# EasyEDA schematic SCH_RE2-YM2151 v0.2_2024-01-16.json

## Sheets
1 OPM: TITLE: Sheet_1; REV: 1.0; Date: 2024-01-08; Sheet: 1/1; Drawn By: Denjhang; Company: Your Company
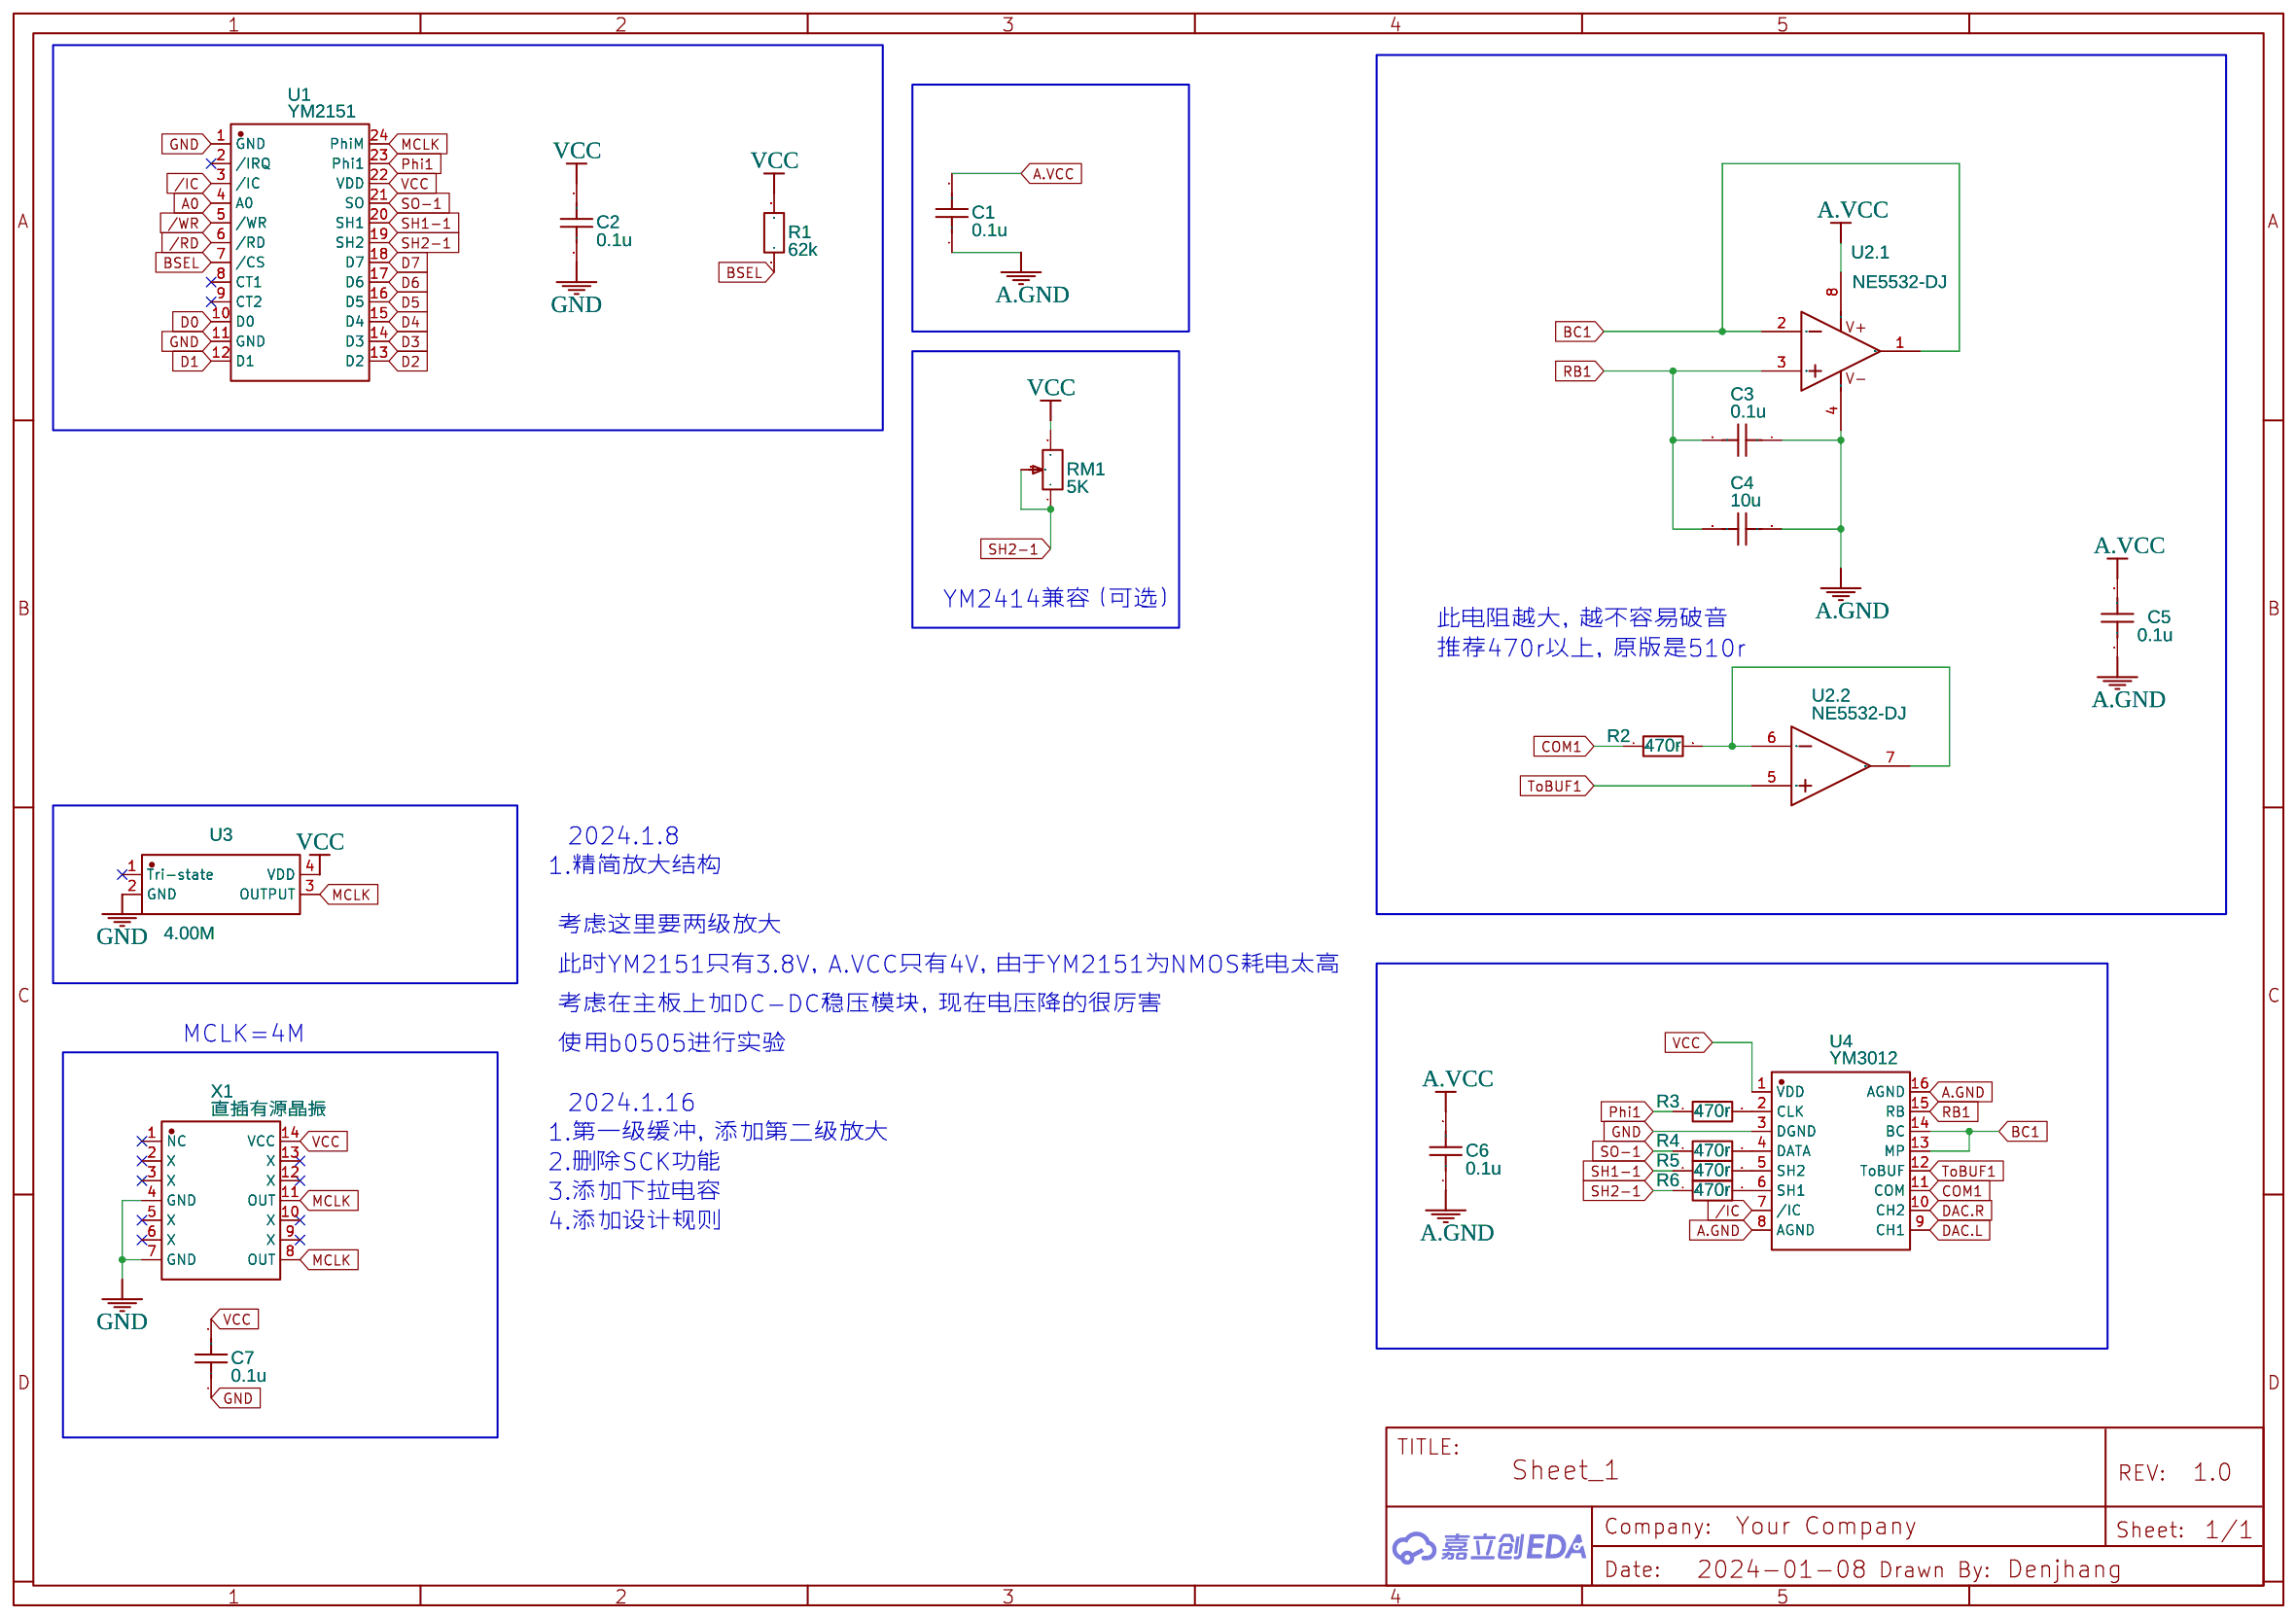
[diagram p0: OPM]
2 BUS: TITLE: Sheet_2
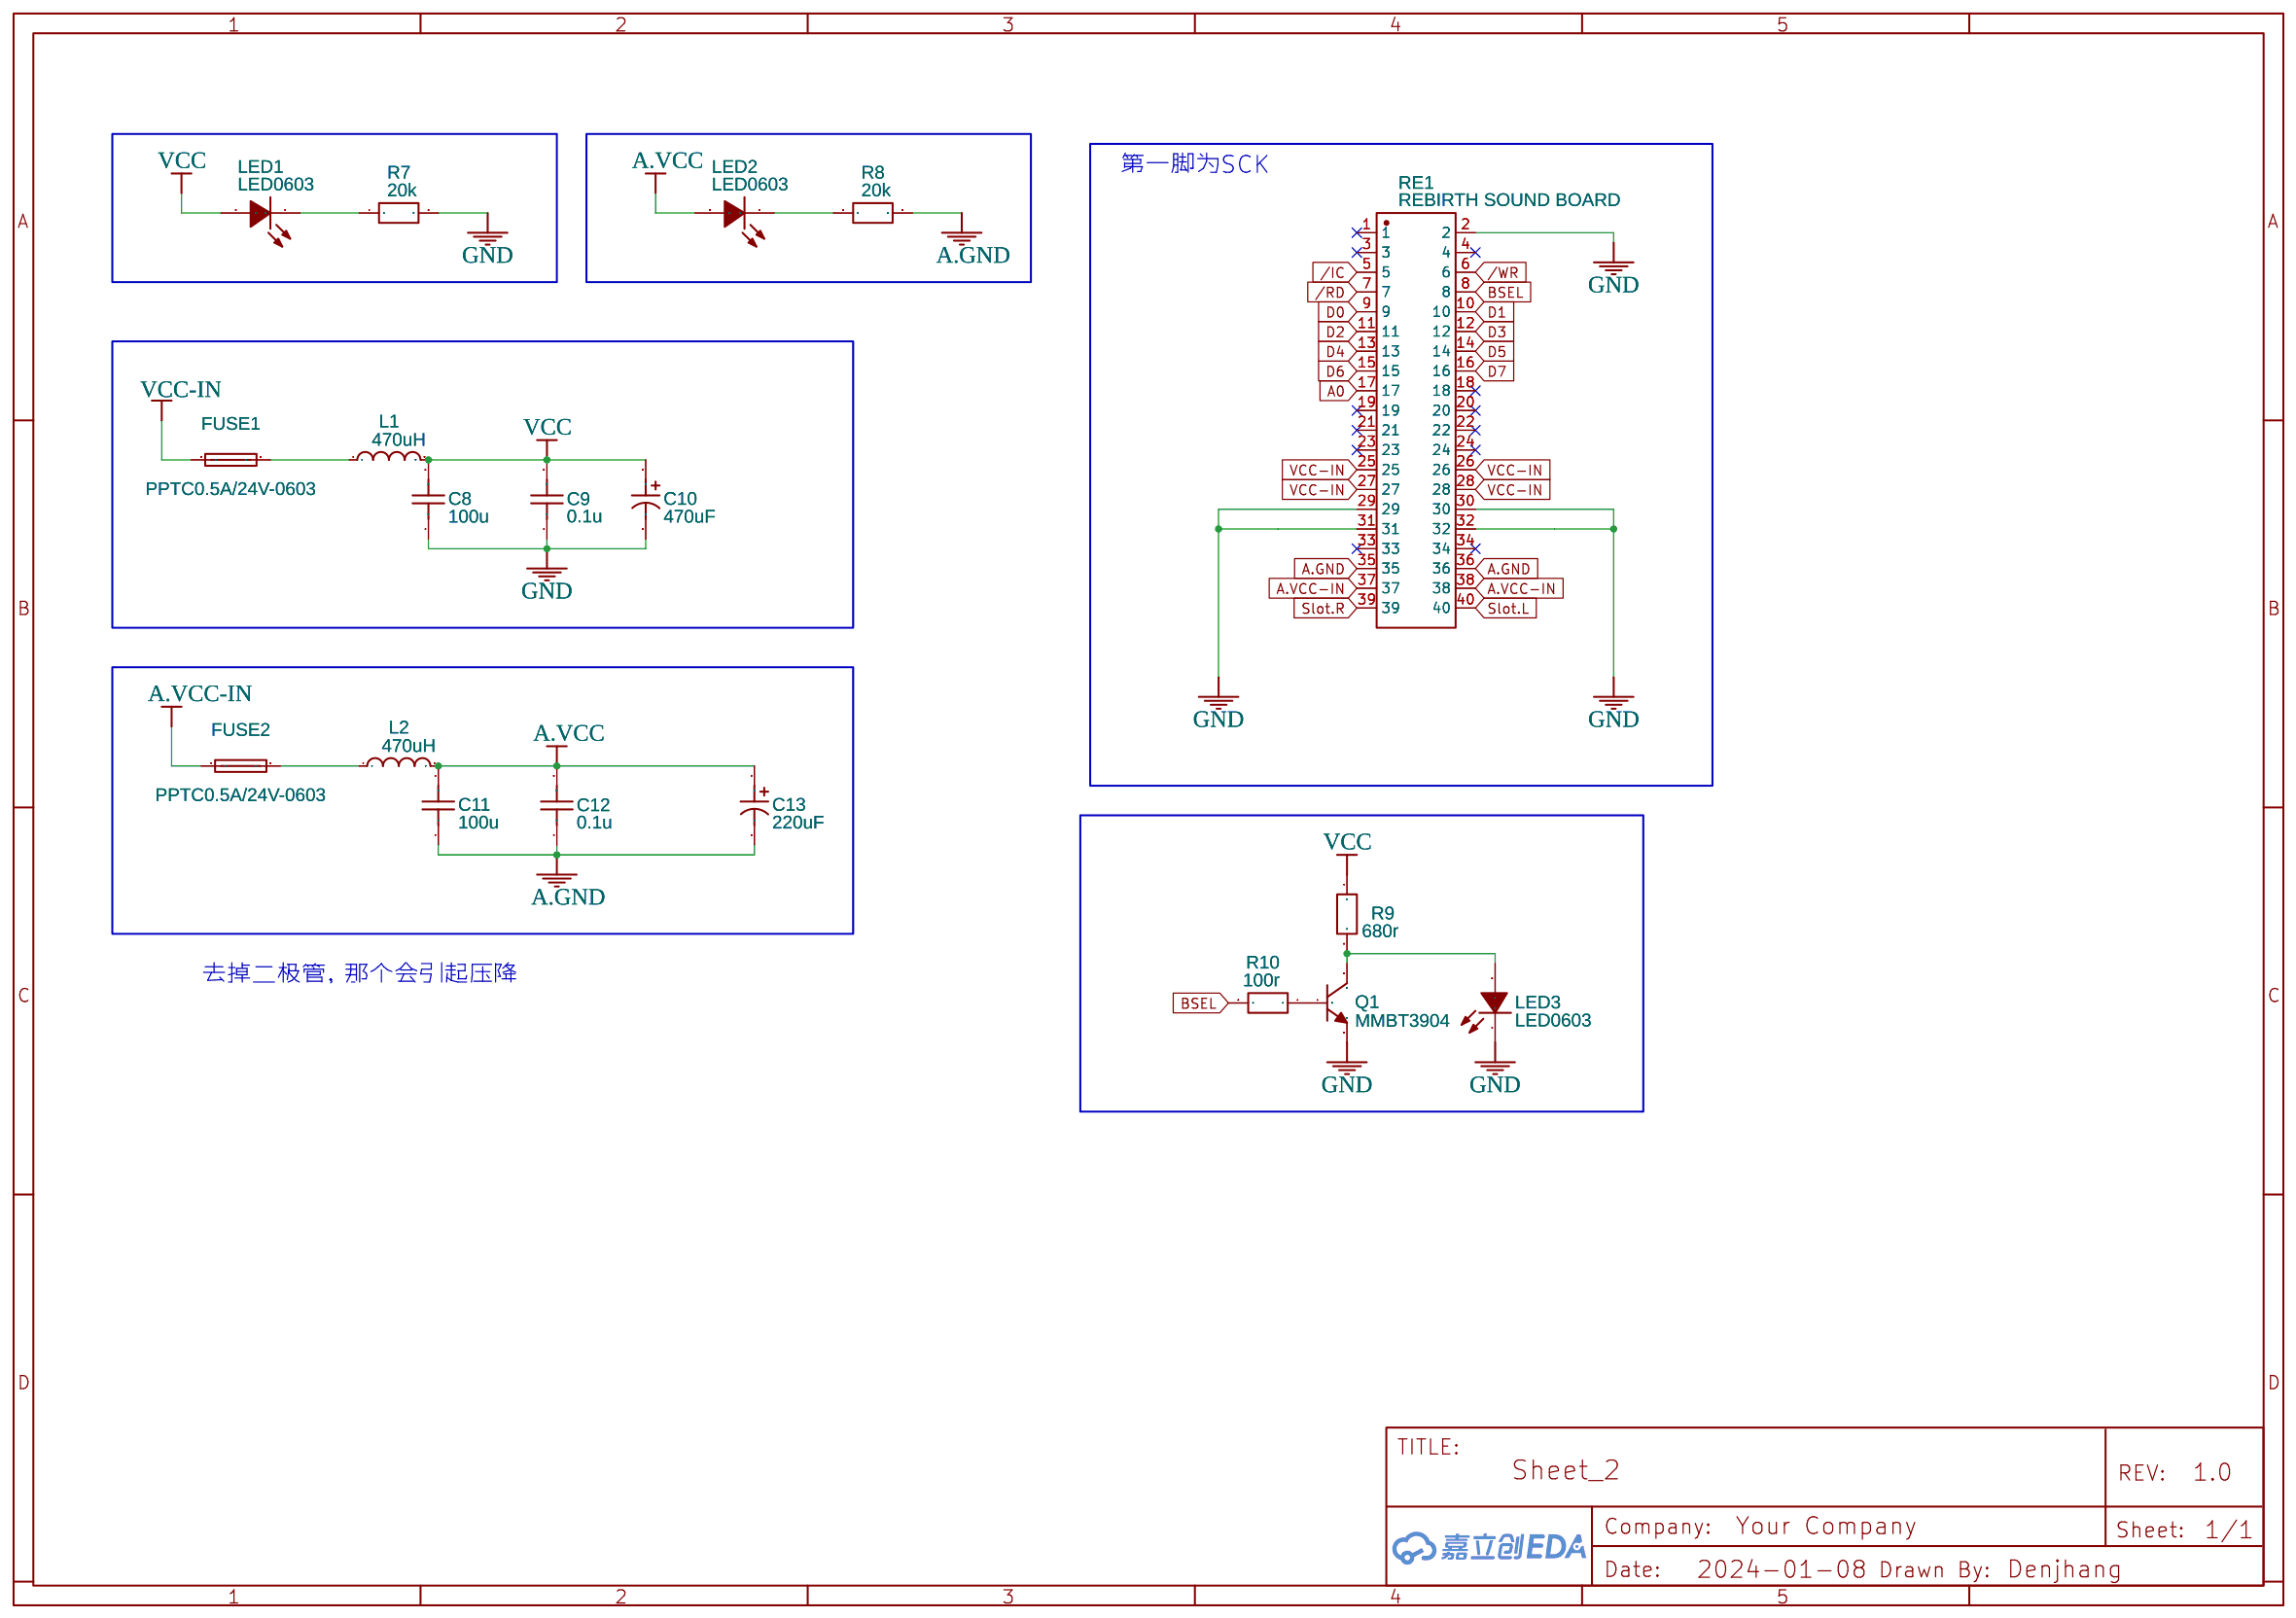
[diagram p1: BUS]
3 AMP1
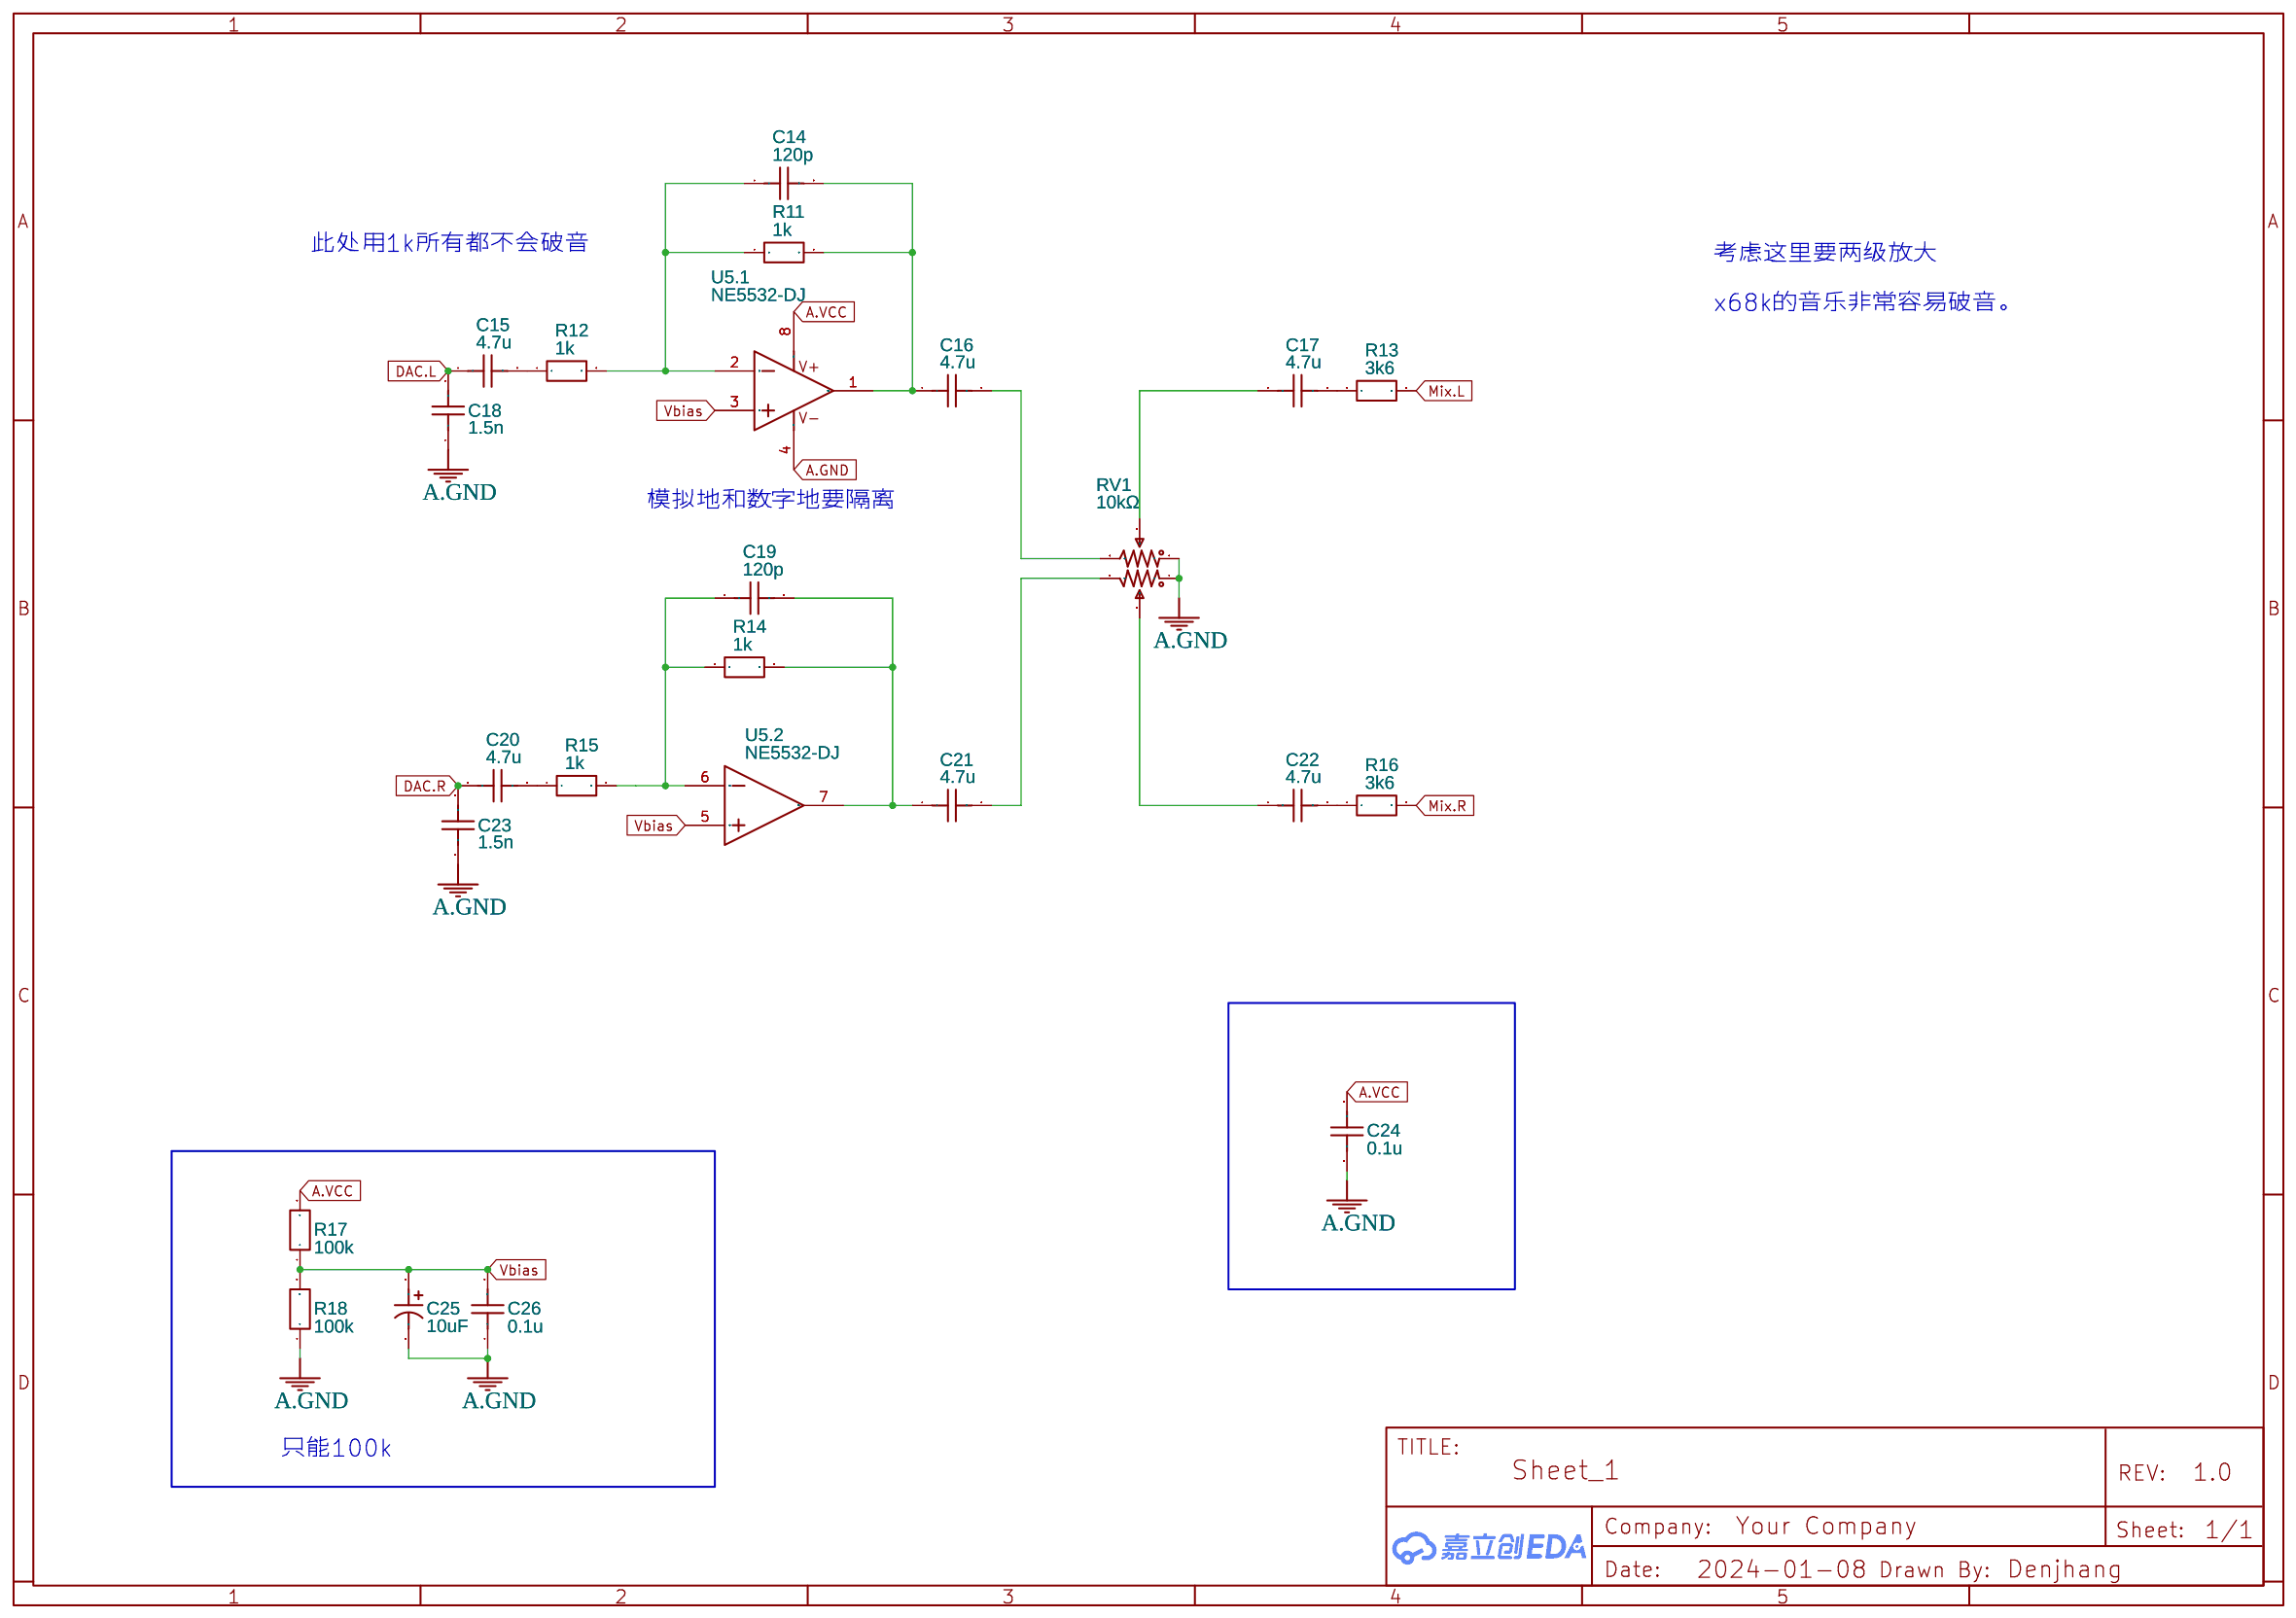
[diagram p2: AMP1]
4 AMP2: Date: 2024-01-16
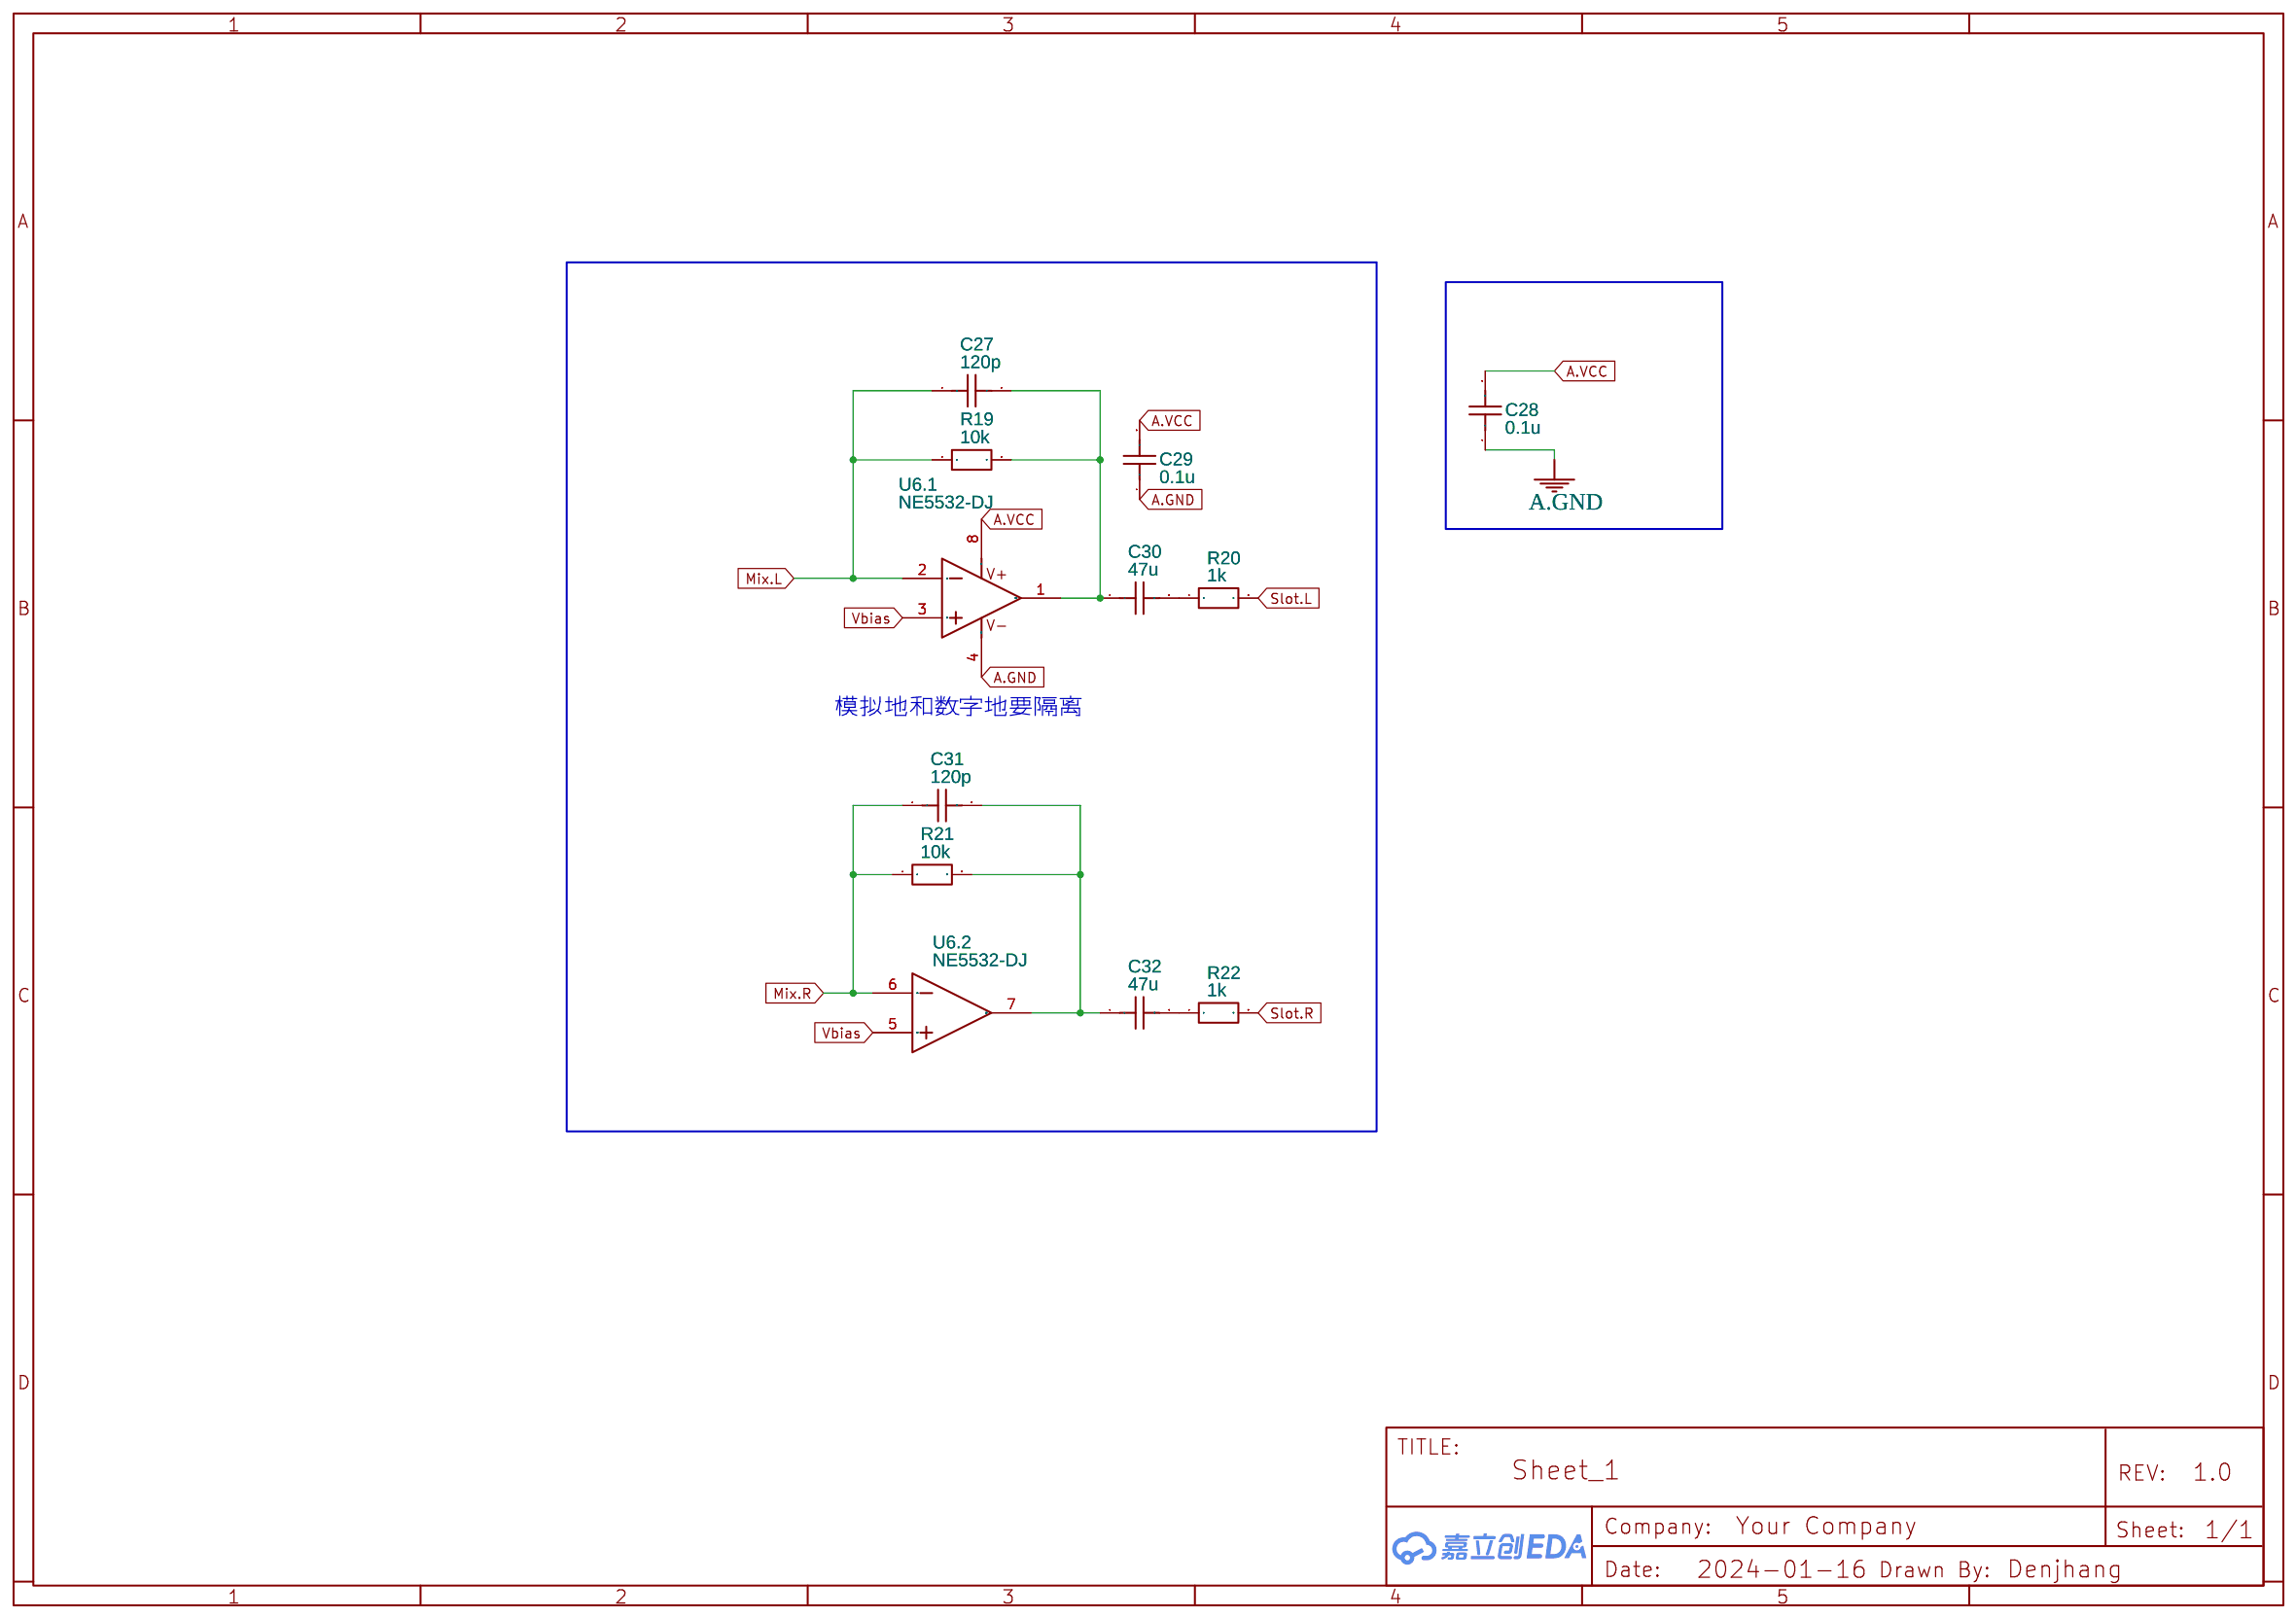
[diagram p3: AMP2]

## Parts
sheet AMP1
C14  120p  [C0603]
C15  4.7u  [C0603]
C16  4.7u  [C0603]
C17  4.7u  [C0603]
C18  1.5n  [C0603]
C19  120p  [C0603]
C20  4.7u  [C0603]
C21  4.7u  [C0603]
C22  4.7u  [C0603]
C23  1.5n  [C0603]
C24  0.1u  [C0603]
C25  10uF  [CAP-SMD_BD5.0-L5.3-W5.3-LS6.0-FD]
C26  0.1u  [C0603]
R11  1k  [R0603]
R12  1k  [R0603]
R13  3k6  [R0603]
R14  1k  [R0603]
R15  1k  [R0603]
R16  3k6  [R0603]
R17  100k  [R0603]
R18  100k  [R0603]
RV1  10kΩ  [RK097G-DJ]
U5  NE5532-DJ  [DIP-8-DJ]  (sections 1,2)
sheet AMP2
C27  120p  [C0603]
C28  0.1u  [C0603]
C29  0.1u  [C0603]
C30  47u  [C0805]
C31  120p  [C0603]
C32  47u  [C0805]
R19  10k  [R0603]
R20  1k  [R0603]
R21  10k  [R0603]
R22  1k  [R0603]
U6  NE5532-DJ  [DIP-8-DJ]  (sections 1,2)
sheet BUS
C8  100u  [C1206]
C9  0.1u  [C0603]
C10  470uF  [CAP-SMD_BD6.3-L6.6-W6.6-FD]
C11  100u  [C1206]
C12  0.1u  [C0603]
C13  220uF  [CAP-SMD_BD6.3-L6.6-W6.6-LS7.2-FD]
FUSE1  PPTC0.5A/24V-0603  [F0603]
FUSE2  PPTC0.5A/24V-0603  [F0603]
L1  470uH  [IND-SMD_L5.8-W5.2]
L2  470uH  [IND-SMD_L5.8-W5.2]
LED1  LED0603  [LED0603-RD]
LED2  LED0603  [LED0603-RD]
LED3  LED0603  [LED0603-RD]
Q1  MMBT3904  [SOT-23-3_L2.9-W1.3-P1.90-LS2.4-BR]
R7  20k  [R0603]
R8  20k  [R0603]
R9  680r  [R0603]
R10  100r  [R0603]
RE1  REBIRTH SOUND BOARD  [REBIRTH SOUND BOARD]
sheet OPM
C1  0.1u  [C0603]
C2  0.1u  [C0603]
C3  0.1u  [C0603]
C4  10u  [C0603]
C5  0.1u  [C0603]
C6  0.1u  [C0603]
C7  0.1u  [C0603]
R1  62k  [R0603]
R2  470r  [R0603]
R3  470r  [R0603]
R4  470r  [R0603]
R5  470r  [R0603]
R6  470r  [R0603]
RM1  5K  [RES-ADJ-SMD_RM065-V1]
U1  YM2151  [DIP-24_L31.0-W13.5-P2.54-LS15.2-BL]
U2  NE5532-DJ  [DIP-8-DJ]  (sections 1,2)
U3  4.00M  [OSC-SMD_4P-L3.2-W2.5-BL]
U4  YM3012  [DIP-16_L20.3-W10.2-P2.54-LS7.6-BL-2]
X1  直插有源晶振  [DIP14-有源晶振]

## Library data of the parts
C1-C7 C9 C12 C14-C24 C26-C29 C31 = C_0603_US: Contributor: LCEDA_Lib
C25 = RVT100UF10V67RV0036: Contributor: LCSC; Supplier: LCSC; Supplier Part: C2891567; Manufacturer: KNSCHA(科尼盛); JLCPCB Part Class: Extended Part; link: https://so.szlcsc.com/global.html?k=C2891567&ref=editor
R1-R22 = R_0603_EU: Contributor: LCEDA_Lib
RV1 = RK097-双连体: Contributor: LCSC; Supplier: LCSC; Supplier Part: C231763; Manufacturer: ALPSALPINE(阿尔卑斯阿尔派); Manufacturer Part: RK09712200MY; JLCPCB Part Class: Extended Part
U2 U5 U6 = NE5532-DJ: tags: Audio Operational Amplifier; Supplier Part: C5326; Supplier: LCSC; Manufacturer: TI; Manufacturer Part: NE5532P; subpart_no: 1; image: http://image.lceda.cn/szlcsc/C5326.jpg; JLCPCB Part Class: Extended Part; Contributor: Denjhang
C30 C32 = C_0805_US: Contributor: LCEDA_Lib
C8 C11 = C_1206_US: Contributor: LCEDA_Lib
C10 = RVT220UF16V67RV0015: Contributor: LCSC; Supplier: LCSC; Supplier Part: C2887273; Manufacturer: KNSCHA(科尼盛); JLCPCB Part Class: Extended Part; link: https://so.szlcsc.com/global.html?k=C2887273&ref=editor
C13 = RVT47UF35V67RV0039: Contributor: LCSC; Supplier: LCSC; Supplier Part: C2836440; Manufacturer: KNSCHA(科尼盛); JLCPCB Part Class: Extended Part; link: https://so.szlcsc.com/global.html?k=C2836440&ref=editor
FUSE1 FUSE2 = PPTC0.5A/24V-0603: Contributor: LCSC; Supplier: LCSC; Supplier Part: C9900007586; Manufacturer: null; Manufacturer Part: PPTC0.5A/24V 自恢复保险丝-0603; JLCPCB Part Class: Extended Part
L1 L2 = MSCD54-471KT: Contributor: LCSC; Supplier: LCSC; Supplier Part: C915206; Manufacturer: Meled(美莱); JLCPCB Part Class: Extended Part; link: https://so.szlcsc.com/global.html?k=C915206&ref=editor
LED1-LED3 = LED0603: Supplier: LCSC; Supplier Part: C2892154; Manufacturer: GBG; Manufacturer Part: GBG-C192KRKT; link: https://atta.szlcsc.comnull; Contributor: Denjhang
Q1 = MMBT3904: Supplier: LCSC; Manufacturer: CJ; Supplier Part: C20526; Contributor: Denjhang; JLCPCB Part Class: Basic Part
RE1 = REBIRTH SOUND BOARD: Contributor: lcsc; Supplier: LCSC; Supplier Part: C5242133; Manufacturer: XKB Connectivity(中国星坤); Manufacturer Part: X6522WR-2x20H-C60D30-E43F03
RM1 = RM065-DJ: Supplier: LCSC; Manufacturer: ReliaPro; Manufacturer Part: Blue and white adjustable resistance RM065-V1-102; Supplier Part: C53566; Contributor: Denjhang
U1 = YM2151: Contributor: Denjhang
U3 = OT32254MJBA4SL: Contributor: lcsc; Supplier: LCSC; Supplier Part: C2831397; Manufacturer: YXC(扬兴晶振); JLCPCB Part Class: Extended Part; link: https://so.szlcsc.com/global.html?k=C2831397&ref=editor
U4 = YM3012: Contributor: Denjhang
X1 = 直插有源晶振: Contributor: denjhang

## Nets
GND: C2.2 C7.1 C8.1 C9.1 C10.2 LED3.1(C) Q1.2(E) R7.2 RE1.2 RE1.29 RE1.30 RE1.31 RE1.32 U1.1(GND) U1.11(GND) U3.2(GND) U4.3(DGND) X1.4(GND) X1.7(GND)
VCC: C2.1 C7.2 C8.2 C9.2 C10.1 L1.2 LED1.2(A) R1.2 R9.1 RM1.3 U1.22(VDD) U3.4(VDD) U4.1(VDD) X1.14(VCC)
VCC-IN: FUSE1.1 RE1.25 RE1.26 RE1.27 RE1.28
/IC: RE1.5 U1.3(/IC) U4.7(/IC)
/RD: RE1.7 U1.6(/RD)
/WR: RE1.6 U1.5(/WR)
A0: RE1.17 U1.4(A0)
A.GND: C1.1 C3.1 C4.1 C5.1 C6.1 C11.1 C12.1 C13.2 C18.1 C23.1 C24.1 C25.2 C26.1 C28.1 C29.1 R8.2 R18.1 RE1.35 RE1.36 RV1.1 RV1.4 U2.4(VCC-) U4.8(AGND) U4.16(AGND) U5.4(VCC-) U6.4(VCC-)
A.VCC: C1.2 C5.2 C6.2 C11.2 C12.2 C13.1 C24.2 C28.2 C29.2 L2.2 LED2.2(A) R17.2 U2.8(VCC+) U5.8(VCC+) U6.8(VCC+)
A.VCC-IN: FUSE2.1 RE1.37 RE1.38
BC1: U2.1(OUT1) U2.2(IN1-) U4.13(MP) U4.14(BC)
BSEL: R1.1 R10.2 RE1.8 U1.7(/CS)
COM1: R2.1 U4.11(COM)
D0: RE1.9 U1.10(D0)
D1: RE1.10 U1.12(D1)
D2: RE1.11 U1.13(D2)
D3: RE1.12 U1.14(D3)
D4: RE1.13 U1.15(D4)
D5: RE1.14 U1.16(D5)
D6: RE1.15 U1.17(D6)
D7: RE1.16 U1.18(D7)
DAC.L: C15.1 C18.2 U4.9(CH1)
DAC.R: C20.1 C23.2 U4.10(CH2)
MCLK: U1.24(PhiM) U3.3(OUTPUT) X1.8(OUT) X1.11(OUT)
Mix.L: C27.1 R13.2 R19.1 U6.2(IN1-)
Mix.R: C31.1 R16.2 R21.1 U6.6(IN2-)
Phi1: R3.1 U1.23(Phi1)
RB1: C3.2 C4.2 U2.3(IN1+) U4.15(RB)
SH1-1: R5.1 U1.20(SH1)
SH2-1: R6.1 RM1.1 RM1.2 U1.19(SH2)
Slot.L: R20.2 RE1.40
Slot.R: R22.2 RE1.39
SO-1: R4.1 U1.21(SO)
ToBUF1: U2.5(IN2+) U4.12(ToBUF)
Vbias: C25.1 C26.2 R17.1 R18.2 U5.3(IN1+) U5.5(IN2+) U6.3(IN1+) U6.5(IN2+)
Net-(C14-1): C14.1 R11.1 R12.2 U5.2(IN1-)
Net-(C14-2): C14.2 C16.1 R11.2 U5.1(OUT1)
Net-(C15-2): C15.2 R12.1
Net-(C16-2): C16.2 RV1.3
Net-(C17-1): C17.1 RV1.2
Net-(C17-2): C17.2 R13.1
Net-(C19-1): C19.1 R14.1 R15.2 U5.6(IN2-)
Net-(C19-2): C19.2 C21.1 R14.2 U5.7(OUT2)
Net-(C20-2): C20.2 R15.1
Net-(C21-2): C21.2 RV1.6
Net-(C22-1): C22.1 RV1.5
Net-(C22-2): C22.2 R16.1
Net-(C27-2): C27.2 C30.1 R19.2 U6.1(OUT1)
Net-(C30-2): C30.2 R20.1
Net-(C31-2): C31.2 C32.1 R21.2 U6.7(OUT2)
Net-(C32-2): C32.2 R22.1
Net-(FUSE1-2): FUSE1.2 L1.1
Net-(FUSE2-2): FUSE2.2 L2.1
Net-(LED1-1): LED1.1(C) R7.1
Net-(LED2-1): LED2.1(C) R8.1
Net-(LED3-2): LED3.2(A) Q1.3(C) R9.2
Net-(Q1-1): Q1.1(B) R10.1
Net-(R2-2): R2.2 U2.6(IN2-) U2.7(OUT2)
Net-(R3-2): R3.2 U4.2(CLK)
Net-(R4-2): R4.2 U4.4(DATA)
Net-(R5-2): R5.2 U4.5(SH2)
Net-(R6-2): R6.2 U4.6(SH1)

Not connected (* = marked no-connect by the designer): RE1 1* 3* 4* 18* 19* 20* 21* 22* 23* 24* 33* 34*; U1 2(/IRQ)* 8(CT1)* 9(CT2)*; U3 1(Tri-state)*; X1 1(NC)* 2(X)* 3(X)* 5(X)* 6(X)* 9(X)* 10(X)* 12(X)* 13(X)*

## Notes on the sheets
sheet 1
- YM2414兼容（可选）
- 此电阻越大，越不容易破音
- 推荐470r以上，原版是510r
- 2024.1.8
- 1.精简放大结构
- 考虑这里要两级放大
- 此时YM2151只有3.8V，A.VCC只有4V，由于YM2151为NMOS耗电太高
- 考虑在主板上加DC-DC稳压模块，现在电压降的很厉害
- MCLK=4M
- 使用b0505进行实验
- 2024.1.16
- 1.第一级缓冲，添加第二级放大
- 2.删除SCK功能
- 3.添加下拉电容
- 4.添加设计规则
sheet 2
- 第一脚为SCK
- 去掉二极管，那个会引起压降
sheet 3
- 此处用1k所有都不会破音
- 考虑这里要两级放大
- x68k的音乐非常容易破音。
- 模拟地和数字地要隔离
- 只能100k
sheet 4
- 模拟地和数字地要隔离
